# Altium schematic sheet Sheet4.SchDoc
size A4
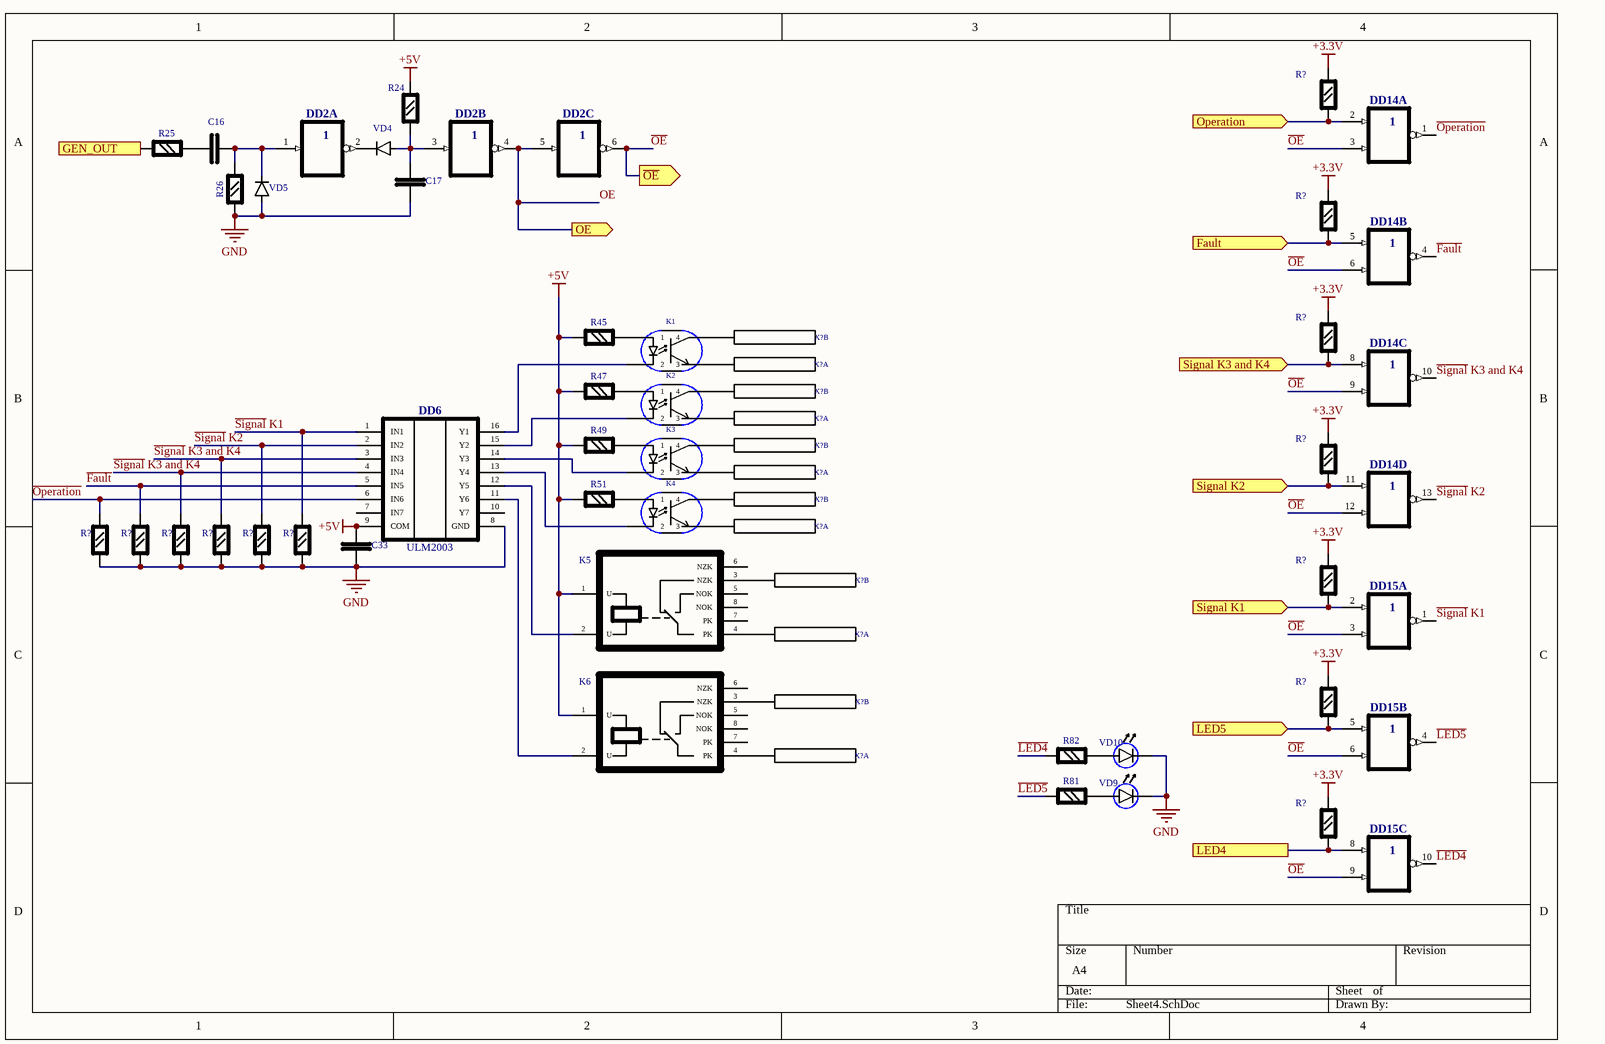
[diagram p0: Sheet4.SchDoc]

## Parts
(Parts that share a designator on the sheet are numbered #1, #2 ... from top to bottom, then left to right.)
C16  CAP_0805  [CAP_0805]  (value not drawn)
C17  CAP_0805  [CAP_0805]  (value not drawn)
C33  CAP_0805  [CAP_0805]  (value not drawn)
DD2  74HC04_1  [SOIC14_1]  (value not drawn)  (parts A,B,C of 6)
DD6  ULM2003  [SOIC16_1]
DD14  74HC02  [SOIC14]  (value not drawn)  (parts A,B,C,D of 4)
DD15  74HC02  [SOIC14]  (value not drawn)  (parts A,B,C of 4)
K1  HMA2701  [HMA2701_HMA2701(Primary)]  (value not drawn)
K2  HMA2701  [HMA2701_HMA2701(Primary)]  (value not drawn)
K3  HMA2701  [HMA2701_HMA2701(Primary)]  (value not drawn)
K4  HMA2701  [HMA2701_HMA2701(Primary)]  (value not drawn)
K5  RT314  [RT314]  (value not drawn)
K6  RT314  [RT314]  (value not drawn)
R24  RES_0805  [RES_0805]  (value not drawn)
R25  RES_0805  [RES_0805]  (value not drawn)
R26  RES_0805  [RES_0805]  (value not drawn)
R45  RES_0805  [RES_0805]  (value not drawn)
R47  RES_0805  [RES_0805]  (value not drawn)
R49  RES_0805  [RES_0805]  (value not drawn)
R51  RES_0805  [RES_0805]  (value not drawn)
R81  RES_0805  [RES_0805]  (value not drawn)
R82  RES_0805  [RES_0805]  (value not drawn)
R?#1  RES_0805  [RES_0805]  (value not drawn)
R?#2  RES_0805  [RES_0805]  (value not drawn)
R?#3  RES_0805  [RES_0805]  (value not drawn)
R?#4  RES_0805  [RES_0805]  (value not drawn)
R?#5  RES_0805  [RES_0805]  (value not drawn)
R?#6  RES_0805  [RES_0805]  (value not drawn)
R?#7  RES_0805  [RES_0805]  (value not drawn)
R?#8  RES_0805  [RES_0805]  (value not drawn)
R?#9  RES_0805  [RES_0805]  (value not drawn)
R?#10  RES_0805  [RES_0805]  (value not drawn)
R?#11  RES_0805  [RES_0805]  (value not drawn)
R?#12  RES_0805  [RES_0805]  (value not drawn)
R?#13  RES_0805  [RES_0805]  (value not drawn)
VD4  VD1_GORIZ  [VD1]  (value not drawn)
VD5  VD1_VERT  [VD1]  (value not drawn)
VD9  VDR_V  [LED1_VDR_V(Primary)]  (value not drawn)
VD10  VDR_V  [LED1_VDR_V(Primary)]  (value not drawn)
X?#1  DFK-MSTBA2.5/2-GF-5.08  [DFK_MSTBA2_ALL]  (value not drawn)  (part B of 2)
X?#2  DFK-MSTBA2.5/2-GF-5.08  [DFK_MSTBA2_ALL]  (value not drawn)  (part A of 2)
X?#3  DFK-MSTBA2.5/2-GF-5.08  [DFK_MSTBA2_ALL]  (value not drawn)  (part B of 2)
X?#4  DFK-MSTBA2.5/2-GF-5.08  [DFK_MSTBA2_ALL]  (value not drawn)  (part A of 2)
X?#5  DFK-MSTBA2.5/2-GF-5.08  [DFK_MSTBA2_ALL]  (value not drawn)  (part B of 2)
X?#6  DFK-MSTBA2.5/2-GF-5.08  [DFK_MSTBA2_ALL]  (value not drawn)  (part A of 2)
X?#7  DFK-MSTBA2.5/2-GF-5.08  [DFK_MSTBA2_ALL]  (value not drawn)  (part B of 2)
X?#8  DFK-MSTBA2.5/2-GF-5.08  [DFK_MSTBA2_ALL]  (value not drawn)  (part A of 2)
X?#9  DFK-MSTBA2.5/2-GF-5.08  [DFK_MSTBA2_ALL]  (value not drawn)  (part B of 2)
X?#10  DFK-MSTBA2.5/2-GF-5.08  [DFK_MSTBA2_ALL]  (value not drawn)  (part A of 2)
X?#11  DFK-MSTBA2.5/2-GF-5.08  [DFK_MSTBA2_ALL]  (value not drawn)  (part B of 2)
X?#12  DFK-MSTBA2.5/2-GF-5.08  [DFK_MSTBA2_ALL]  (value not drawn)  (part A of 2)

## Ports
Fault (in), GEN_OUT (in), LED4, LED5 (in), OE (out), Operation (in), Signal K1 (in), Signal K2 (in), Signal K3 and K4 (in), ~{OE} (out)

## Nets
+3.3V: R?#1.2(D2) R?#2.2(D2) R?#3.2(D2) R?#4.2(D2) R?#11.2(D2) R?#12.2(D2) R?#13.2(D2)
+5V: C33.2(D2) DD6.9(COM) K5.1(U) K6.1(U) R24.2(D2) R45.1(D1) R47.1(D1) R49.1(D1) R51.1(D1)
GND: C17.1(D1) C33.1(D1) DD6.8(GND) R26.1(D1) R?#5.1(D1) R?#6.1(D1) R?#7.1(D1) R?#8.1(D1) R?#9.1(D1) R?#10.1(D1) VD5.2(d2) VD9.C VD10.C
~{Fault}: DD6.5(IN5) DD14.4(Y) R?#6.2(D2)
Fault: DD14.5(A) R?#2.1(D1) ; port Fault
GEN_OUT: R25.1(D1) ; port GEN_OUT
~{LED4}: DD15.10(Y) R82.1(D1)
~{LED5}: DD15.4(Y) R81.1(D1)
LED4: DD15.8(A) R?#13.1(D1) ; port LED4
LED5: DD15.5(A) R?#12.1(D1) ; port LED5
~{OE}: DD2.6(Y) DD14.3(B) DD14.6(B) DD14.9(B) DD14.12(B) DD15.3(B) DD15.6(B) DD15.9(B) ; port ~{OE}
~{Operation}: DD6.6(IN6) DD14.1(Y) R?#5.2(D2)
OE: DD2.4(Y) DD2.5(A) ; port OE
Operation: DD14.2(A) R?#1.1(D1) ; port Operation
~{Signal} K1: DD6.1(IN1) DD15.1(Y) R?#10.2(D2)
~{Signal} K2: DD6.2(IN2) DD14.13(Y) R?#9.2(D2)
~{Signal} K3 and K4: DD6.3(IN3) DD6.4(IN4) DD14.10(Y) R?#7.2(D2) R?#8.2(D2)
Signal K1: DD15.2(A) R?#11.1(D1) ; port Signal K1
Signal K2: DD14.11(A) R?#4.1(D1) ; port Signal K2
Signal K3 and K4: DD14.8(A) R?#3.1(D1) ; port Signal K3 and K4
NetC16_1: C16.1(D1) DD2.1(A) R26.2(D2) VD5.1(d1)
NetC16_2: C16.2(D2) R25.2(D2)
NetC17_2: C17.2(D2) DD2.3(A) R24.1(D1) VD4.2(D2)
NetDD2_2: DD2.2(Y) VD4.1(D1)
NetDD6_11: DD6.11(Y6) K6.2(U)
NetDD6_12: DD6.12(Y5) K5.2(U)
NetDD6_13: DD6.13(Y4) K4.Cathod(2)
NetDD6_14: DD6.14(Y3) K3.Cathod(2)
NetDD6_15: DD6.15(Y2) K2.Cathod(2)
NetDD6_16: DD6.16(Y1) K1.Cathod(2)
NetK1_Anod: K1.Anod(1) R45.2(D2)
NetK1_Collector: K1.Collector(4) X?#1.2
NetK1_Emitter: K1.Emitter(3) X?#2.1
NetK2_Anod: K2.Anod(1) R47.2(D2)
NetK2_Collector: K2.Collector(4) X?#3.2
NetK2_Emitter: K2.Emitter(3) X?#4.1
NetK3_Anod: K3.Anod(1) R49.2(D2)
NetK3_Collector: K3.Collector(4) X?#5.2
NetK3_Emitter: K3.Emitter(3) X?#6.1
NetK4_Anod: K4.Anod(1) R51.2(D2)
NetK4_Collector: K4.Collector(4) X?#7.2
NetK4_Emitter: K4.Emitter(3) X?#8.1
NetK5_3: K5.3(NZK) X?#9.2
NetK5_4: K5.4(PK) X?#10.1
NetK6_3: K6.3(NZK) X?#11.2
NetK6_4: K6.4(PK) X?#12.1
NetR81_2: R81.2(D2) VD9.A
NetR82_2: R82.2(D2) VD10.A

Not connected (* = marked no-connect by the designer): DD2 7(GND) 14(+5V); DD6 7(IN7) 10(Y7); DD14 7(GND) 14(VCC); DD15 7(GND) 14(VCC); K5 5(NOK) 6(NZK) 7(PK) 8(NOK); K6 5(NOK) 6(NZK) 7(PK) 8(NOK); X?#1 3 4; X?#2 3 4; X?#3 3 4; X?#4 3 4; X?#5 3 4; X?#6 3 4; X?#7 3 4; X?#8 3 4; X?#9 3 4; X?#10 3 4; X?#11 3 4; X?#12 3 4

## Library data of the parts
DD2 = 74HC04_1: Hex INVERTERS; Value: *
DD14 DD15 = 74HC02: Quadruple 2-Input Positive-NAND Gates; Value: *
C16 C17 C33 = CAP_0805: Value: *
DD6 = ULM2003: Value: *
K1-K4 = HMA2701: Value: *
K5 K6 = RT314: Value: *
R24-R26 R45 R47 R49 R51 R81 R82 R?#1-R?#13 = RES_0805: Value: *
VD4 = VD1_GORIZ: Value: *
VD5 = VD1_VERT: Value: *
VD9 VD10 = VDR_V: Value: *
X?#1-X?#12 = DFK-MSTBA2.5/2-GF-5.08: Value: *